# Altium schematic sheet Cc and Cv.SchDoc
size A; SheetNumber: 1; SheetTotal: 1
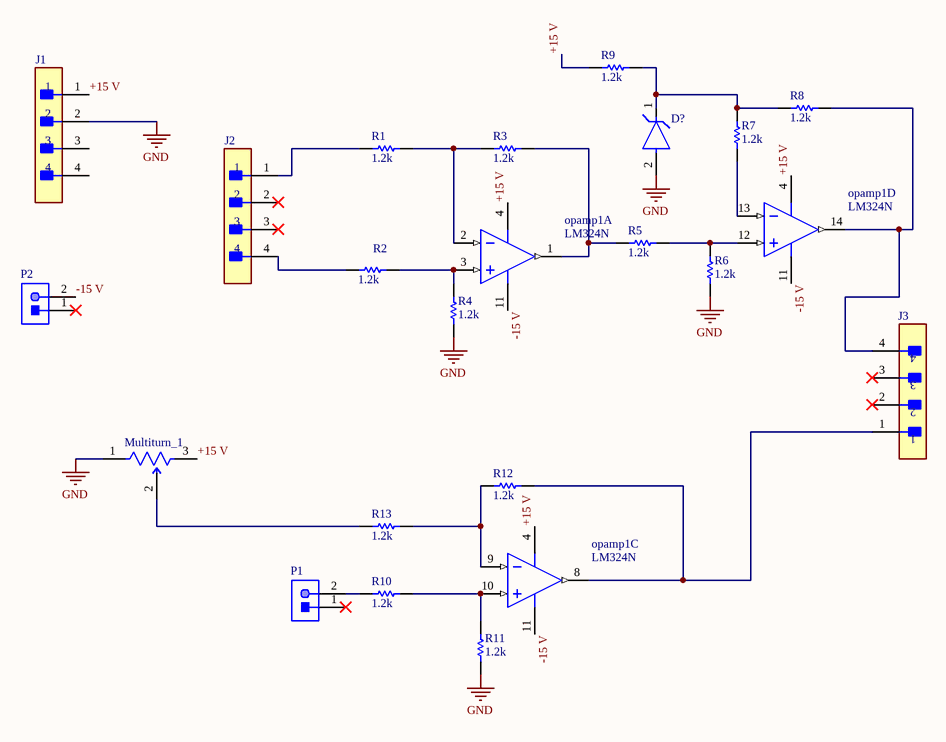
[diagram p0: Cc and Cv.SchDoc]

## Parts
D?  (no value)  [FP-6_561-5001_02-4-MFG]
J1  (no value)  [FP-47053-3000-MFG]
J2  (no value)  [FP-47053-3000-MFG]
J3  (no value)  [FP-47053-3000-MFG]
Multiturn_1  (no value)  [FP-3296W-MFG]
opamp1  LM324N  [N0014A]  (parts A,C,D of 4)
P1  (no value)  [61300211121]
P2  (no value)  [61300211121]
R1  1.2k  [OMTE-RES7X2.5-2]
R2  1.2k  [OMTE-RES7X2.5-2]
R3  1.2k  [OMTE-RES7X2.5-2]
R4  1.2k  [OMTE-RES7X2.5-2]
R5  1.2k  [OMTE-RES7X2.5-2]
R6  1.2k  [OMTE-RES7X2.5-2]
R7  1.2k  [OMTE-RES7X2.5-2]
R8  1.2k  [OMTE-RES7X2.5-2]
R9  1.2k  [OMTE-RES7X2.5-2]
R10  1.2k  [OMTE-RES7X2.5-2]
R11  1.2k  [OMTE-RES7X2.5-2]
R12  1.2k  [OMTE-RES7X2.5-2]
R13  1.2k  [OMTE-RES7X2.5-2]

## Nets
GND: D?.2(A) J1.2 Multiturn_1.1(CCW) R4.1 R6.2 R11.2
+15 V: J1.1 Multiturn_1.3(CW) opamp1.4(V+) R9.2
-15 V: opamp1.11(GND) P2.2
NetD?_1: D?.1(C) R7.1 R8.1 R9.1
NetJ2_1: J2.1 R1.2
NetJ2_4: J2.4 R2.2
NetJ3_1: J3.1 opamp1.8(OUT3) R12.1
NetJ3_4: J3.4 opamp1.14(OUT4) R8.2
NetMultiturn_1_2: Multiturn_1.2(WIPER) R13.2
Netopamp1_1: opamp1.1(OUT1) R3.1 R5.2
Netopamp1_2: opamp1.2(IN1-) R1.1 R3.2
Netopamp1_3: opamp1.3(IN1+) R2.1 R4.2
Netopamp1_9: opamp1.9(IN3-) R12.2 R13.1
Netopamp1_10: opamp1.10(IN3+) R10.1 R11.1
Netopamp1_12: opamp1.12(IN4+) R5.1 R6.1
Netopamp1_13: opamp1.13(IN4-) R7.2
NetP1_2: P1.2 R10.2

Not connected (* = marked no-connect by the designer): J1 3 4; J2 2* 3*; J3 2* 3*; P1 1*; P2 1*

## Library data of the parts
D? = CMP-02541-000001-1: DIODE ZENER 15V 1.3W DO41; Manufacturer: Vishay; Manufacturer Part Number: BZX85C15-TAP; Max Reverse Leakage Current: 0.5uA; Reverse Voltage: 11V; Max Zener Voltage: 15.6V; Zener Impedance: 15Ω; Max Junction Temp: +175°C; Power Dissipation: 1300mW; Automotive Grade: Grade 0; Device Class L3: Zener Diodes; Device Class L1: Discrete Semiconductors; Automotive: Yes; Mouser Description: Zener Diodes 15 Volt 1.3 Watt 5%; Lead Free: Yes; Height: 2.6mm; Octopart: https://octopart.com/bzx85c15-tap-vishay-55401762; Temperature: to +175°C; Digikey Description: DIODE ZENER 15V 1.3W DO41; ComponentLink2URL: http://www.vishay.com/docs/85607/bzx85.pdf; Device Class L2: Diodes; RoHS: TRUE; Temperature Range High: +175°C; ComponentLink2Description: Datasheet; Package: 6.561-5001.02-4; Category: Diode; Nom Zener Voltage: 15V
J1-J3 = CMP-04776-000447-1: CONN HEADER VERT 4POS 2.54MM; Glow Wire Compliant: Non-compliant; Voltage Rating: 250V; Current Rating: 4A; Number of Circuits: 4; Gender: Male; Orientation: Straight; Packaging: Bulk; Series: 47053; RoHS Compliant: Yes; Termination: Through Hole; Contact Plating: Tin; Mount: Through Hole; Number of Rows: 1; Pitch: 2.54mm; Halogen Free: Low Halogen; Number of Contacts: 4; Min Operating Temperature: 0°C; Package Quantity: 12000; Contact Material: Copper Alloy; Max Operating Temperature: 75°C; REACH SVHC: No SVHC; Number of Positions: 4
Multiturn_1 = CMP-07234-000043-1: TRIMMER 50K OHM 0.5W PC PIN TOP; Manufacturer Series: 3296; Resistance Tolerance: 10%; Actuator Orientation: Vertical; Resistance: 50kR; Number of Turns: 25; Power Rating: 500mW; Insulation Resistance: 1GR; Actuator Type: SCREW; Resistance Law: Linear; Number of Terminals/Pins: 3; Temperature Coefficient: 100ppm/°C; Weight: 0.03oz; Length: 9.53mm; Package Quantity: 50; Resistor Type: Cermet; Min Operating Temperature: -55°C; Termination: Pin; Radiation Hardening: No; Terminal Finish: Tin; Height: 0.395inch; Depth: 4.83mm; REACH SVHC: No SVHC; Width: 9.53mm; Packaging: Rail/Tube; RoHS Compliant: Yes; Mount: Panel; Max Power Dissipation: 500mW; Taper: Linear; Color: Blue; Technology: CERMET; Lead Free: Lead Free; Max Operating Temperature: 125°C; Number of Pins: 3; Type: Potentiometer; Military Standard: Not; Contact Plating: Tin; Series: 3296; Tolerance: 10%
opamp1 = CMP-0055-00082-3: Low Power Quad Operational Amplifier, 14-pin MDIP; Manufacturer: Texas Instruments; CompType: Amplifiers; PowerWise: N; PackageTopMarking: NSUZXYYTTE#*LM324N; PackageDescription: MDIP, .750 x .250 x.130in, 14 Lead, .100in Pitch; Package Reference: N0014A; RoHS: N; Code_JEDEC: MS-001-AA; ComponentLink1URL: http://www.ti.com/general/docs/lit/getliterature.tsp?genericPartNumber=LM324&fileType=pdf; ComponentLink1Description: Datasheet URL; PinCount: 14
P1 P2 = CMP-1712-00002-4: THT Vertical Pin Header WR-PHD, Pitch 2.54 mm, Single Row, 2 pins; Manufacturer: Wurth Elektronik; Rated Current: 3A; Gender: Male; Withstanding Voltage: 500VAC; Working Voltage: 250VAC; Pitch: 2.54mm; Contact Resistance: 20mOhm; Pin Number: 2; Mounting Technology: THT; Orientation: Vertical; Operating Temperature: -40to105degC; Packaging: Bag; Publisher: WurthElektronik; Datasheet URL: https://katalog.we-online.de/em/datasheet/6130xx11121.pdf; Manufacturer URL: http://www.we-online.de; Row Number: Single; Package Reference: 61300211121; Part Number: 61300211121
R1-R13 = CMP-2000-06865-1: Little Demon(R) Carbon Composition Molded OD Series, 250 V, 10 KOhm, +/-5%, -70 to 130 degC, 2-Pin THD, RoHS, Bulk; PartNumber: OD103JE; Manufacturer: Ohmite; Resistance (Ohms): 10k; Power Rating: 0.25W; Power (Watts): 0.25W,1/4W; Tolerance: ±5%; Online Catalog: OD,OF,OASeries,LittleDemon®; Catalog Drawings: OD,OF,OASeries; EDA / CAD Models: DownloadfromAcceleratedDesigns; Mounting Technology: ThroughHole; Datasheet Version: 06/2016; RoHS Information: LittleDemon"E"SeriesMaterialDeclaration; Number of Terminations: 2; Temperature Coefficient: -; Height: -; Composition: CarbonComposition; Package Description: 2-Pin THD Resistor, Body 7 x 2.5 mm, Lead Dia. 0.6 mm; Size / Dimension: 0.098"Diax0.276"L(2.50mmx7.00mm); Category: Resistors; Manufacturer URL: http://www.ohmite.com/; Features: PulseWithstanding; Family: ThroughHoleResistors; Supplier Device Package: Axial; Package / Case: Axial; Standard Package: 100; Package Reference: RES7X2.5; Operating Temperature: -; Series: LittleDemon®OD; Datasheet URL: http://www.ohmite.com/cat/res_od_of_oa.pdf; Packaging: Bulk